# EAGLE design isobot-bt (EAGLE 5.08)
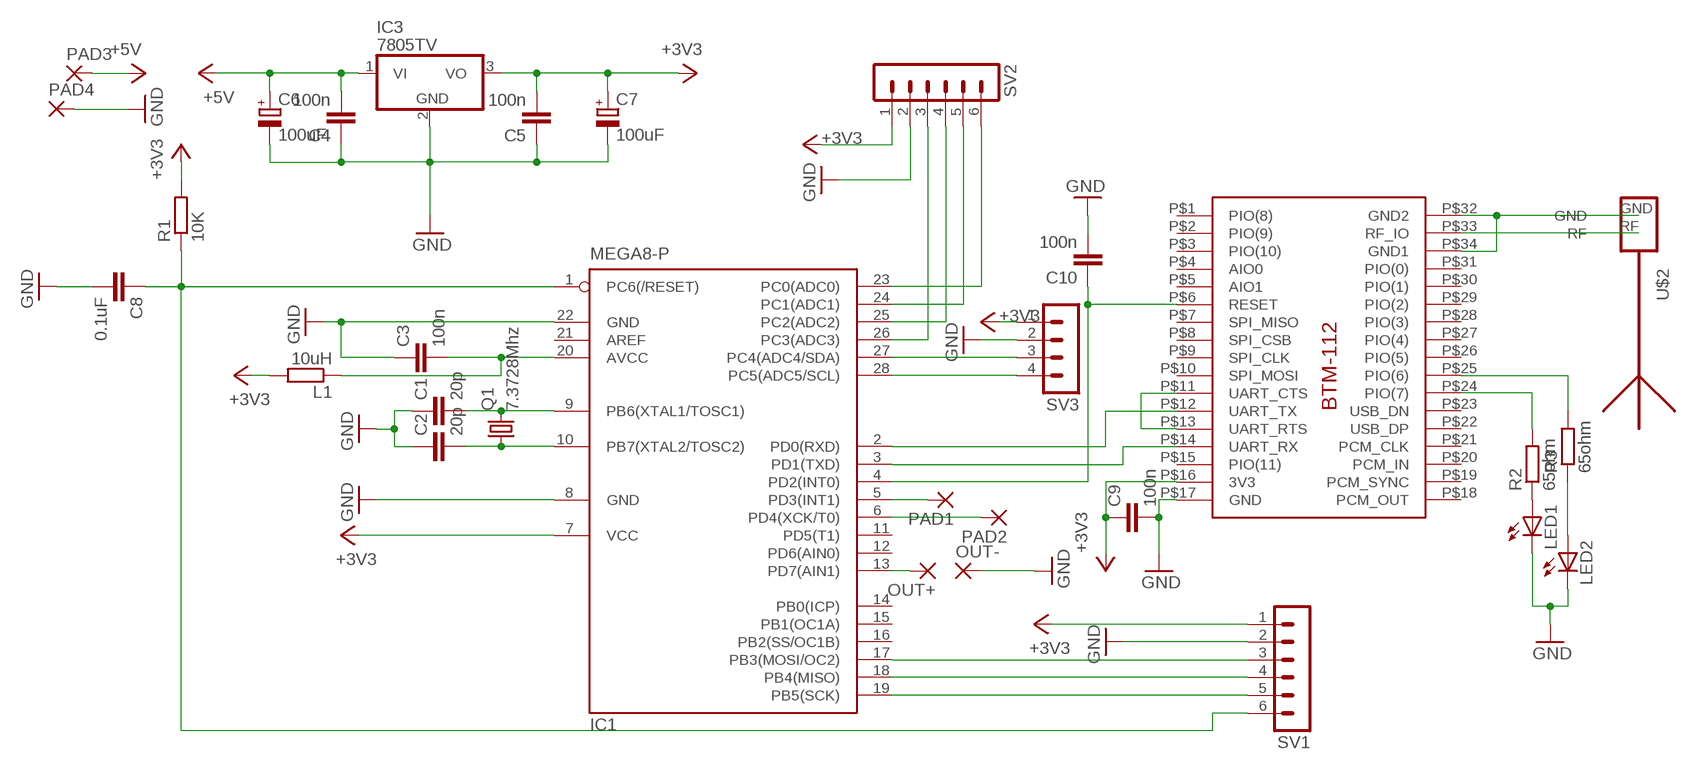
[diagram p0: schematic, sheet 1]

## Parts
C1  20p  C-EU025-025X050  [C025-025X050]
C2  20p  C-EU025-025X050  [C025-025X050]
C3  100n  C-EU025-025X050  [C025-025X050]
C4  100n  C-EU025-025X050  [C025-025X050]
C5  100n  C-EU025-025X050  [C025-025X050]
C6  100uF  CPOL-EUE2,5-6E  [E2,5-6E]
C7  100uF  CPOL-EUE2,5-6E  [E2,5-6E]
C8  0.1uF  C-EU025-025X050  [C025-025X050]
C9  100n  C-EU025-025X050  [C025-025X050]
C10  100n  C-EU025-025X050  [C025-025X050]
IC1  MEGA8-P  [DIL28-3]
IC3  7805TV  [TO220V]
L1  10uH  R-EU_0207/15  [0207/15]
LED1  LED3MM  [LED3MM]
LED2  LED3MM  [LED3MM]
OUT+  2,15/1,0  [2,15/1,0]
OUT-  2,15/1,0  [2,15/1,0]
PAD1  1,6/0,8  [1,6/0,8]
PAD2  1,6/0,8  [1,6/0,8]
PAD3  2,15/1,0  [2,15/1,0]
PAD4  2,15/1,0  [2,15/1,0]
Q1  7.3728Mhz  CRYSTALHC49S  [HC49/S]
R1  10K  R-EU_0207/10  [0207/10]
R2  65ohm  R-EU_0207/10  [0207/10]
R3  65ohm  R-EU_0207/10  [0207/10]
SV1  MA06-1  [MA06-1]
SV2  MA06-1  [MA06-1]
SV3  MA04-1  [MA04-1]
U$1  BTM-112  [BTM-112]
U$2  ANTENNA_1LEFT  [SWRA117D_LEFT]

## Nets
+3V3: C5.2 C7.+ C9.1 IC1.7(VCC) IC3.3(VO) L1.2 R1.2 SV1.1 SV2.1 SV3.1 U$1.P$16(3V3)
+5V: C4.2 C6.+ IC3.1(VI) PAD3.1(P)
GND: C1.1 C2.1 C3.1 C4.1 C5.1 C6.- C7.- C8.2 C9.2 C10.2 IC1.8(GND) IC1.22(GND) IC3.2(GND) LED1.K(C) LED2.K(C) OUT-.1(P) PAD4.1(P) SV1.2 SV2.2 SV3.2 U$1.P$17(GND)
N$1: U$1.P$33(RF_IO) U$2.RF
N$2: U$1.P$32(GND2) U$1.P$34(GND1) U$2.GND
N$3: IC1.3(PD1(TXD)) U$1.P$14(UART_RX)
N$4: IC1.2(PD0(RXD)) U$1.P$12(UART_TX)
N$5: C10.1 IC1.4(PD2(INT0)) U$1.P$6(RESET)
N$6: C1.2 IC1.9(PB6(XTAL1/TOSC1)) Q1.2
N$7: C2.2 IC1.10(PB7(XTAL2/TOSC2)) Q1.1
N$8: C3.2 IC1.20(AVCC) L1.1
N$9: IC1.17(PB3(MOSI/OC2)) SV1.3
N$10: IC1.19(PB5(SCK)) SV1.5
N$11: C8.1 IC1.1(PC6(/RESET)) R1.1 SV1.6
N$12: IC1.18(PB4(MISO)) SV1.4
N$13: IC1.26(PC3(ADC3)) SV2.3
N$14: IC1.25(PC2(ADC2)) SV2.4
N$15: IC1.24(PC1(ADC1)) SV2.5
N$16: IC1.23(PC0(ADC0)) SV2.6
N$17: IC1.28(PC5(ADC5/SCL)) SV3.4
N$18: IC1.27(PC4(ADC4/SDA)) SV3.3
N$19: R3.2 U$1.P$25(PIO(6))
N$20: IC1.13(PD7(AIN1)) OUT+.1(P)
N$21: LED1.A R2.1
N$22: LED2.A R3.1
N$23: R2.2 U$1.P$24(PIO(7))
N$25: IC1.5(PD3(INT1)) PAD1.1(P)
N$26: IC1.6(PD4(XCK/T0)) PAD2.1(P)
N$29: U$1.P$11(UART_CTS) U$1.P$13(UART_RTS)
Unconnected: IC1.11(PD5(T1)) IC1.12(PD6(AIN0)) IC1.14(PB0(ICP)) IC1.15(PB1(OC1A)) IC1.16(PB2(SS/OC1B)) IC1.21(AREF) U$1.P$1(PIO(8)) U$1.P$2(PIO(9)) U$1.P$3(PIO(10)) U$1.P$4(AIO0) U$1.P$5(AIO1) U$1.P$7(SPI_MISO) U$1.P$8(SPI_CSB) U$1.P$9(SPI_CLK) U$1.P$10(SPI_MOSI) U$1.P$15(PIO(11)) U$1.P$18(PCM_OUT) U$1.P$19(PCM_SYNC) U$1.P$20(PCM_IN) U$1.P$21(PCM_CLK) U$1.P$22(USB_DP) U$1.P$23(USB_DN) U$1.P$26(PIO(5)) U$1.P$27(PIO(4)) U$1.P$28(PIO(3)) U$1.P$29(PIO(2)) U$1.P$30(PIO(1)) U$1.P$31(PIO(0))

## Library data of the parts
C1-C5 C8-C10 = rcl:C-EU: CAPACITOR, European symbol
C6 C7 = rcl:CPOL-EU: POLARIZED CAPACITOR, European symbol
IC1 = atmel:MEGA8-P: MICROCONTROLLER 8 Kbytes FLASH, 1 kbytes SRAM, 512 bytes EEPROM, USART, 4-channel 10 bit ADC, 2-channel 8 bit ADC Pin compatible with Atmega48, ATMega88, ATMega168 Source: avr.lbr
IC3 = linear:78*: Positive VOLTAGE REGULATOR Source: http://cache.national.com/ds/LM/LM78L05.pdf http://www.fairchildsemi.com/ds/LM/LM7805.pdf
L1 R1-R3 = rcl:R-EU_: RESISTOR, European symbol
LED1 LED2 = led:LED: LED OSRAM: - CHIPLED LG R971, LG N971, LY N971, LG Q971, LY Q971, LO R971, LY R971 LH N974, LH R974 LS Q976, LO Q976, LY Q976 LO Q996 - Hyper CHIPLED LW Q18S LB Q993, LB Q99A, LB R99A - SideLED LS A670, LO A670, LY A670, LG A670, LP A670 LB A673, LV A673, LT A673, LW A673 LH A674 LY A675 LS A676, LA A676, LO A676, LY A676, LW A676 LS A679, LY A679, LG A679 - Hyper Micro SIDELED® LS Y876, LA Y876, LO Y876, LY Y876 LT Y87S - SmartLED LW L88C, LW L88S LB L89C, LB L89S, LG L890 LS L89K, LO L89K, LY L89K LS L896, LA L896, LO L896, LY L896 - TOPLED LS T670, LO T670, LY T670, LG T670, LP T670 LSG T670, LSP T670, LSY T670, LOP T670, LYG T670 LG T671, LOG T671, LSG T671 LB T673, LV T673, LT T673, LW T673 LH T674 LS T676, LA T676, LO T676, LY T676, LB T676, LH T676, LSB T676, LW T676 LB T67C, LV T67C, LT T67C, LS T67K, LO T67K, LY T67K, LW E67C LS E67B, LA E67B, LO E67B, LY E67B, LB E67C, LV E67C, LT E67C LW T67C LS T679, LY T679, LG T679 LS T770, LO T770, LY T770, LG T770, LP T770 LB T773, LV T773, LT T773, LW T773 LH T774 LS E675, LA E675, LY E675, LS T675 LS T776, LA T776, LO T776, LY T776, LB T776 LHGB T686 LT T68C, LB T68C - Hyper Mini TOPLED® LB M676 - Mini TOPLED Santana® LG M470 LS M47K, LO M47K, LY M47K Source: http://www.osram.convergy.de LUXEON: - LUMILED® LXK2-PW12-R00, LXK2-PW12-S00, LXK2-PW14-U00, LXK2-PW14-V00 LXK2-PM12-R00, LXK2-PM12-S00, LXK2-PM14-U00 LXK2-PE12-Q00, LXK2-PE12-R00, LXK2-PE12-S00, LXK2-PE14-T00, LXK2-PE14-U00 LXK2-PB12-K00, LXK2-PB12-L00, LXK2-PB12-M00, LXK2-PB14-N00, LXK2-PB14-P00, LXK2-PB14-Q00 LXK2-PR12-L00, LXK2-PR12-M00, LXK2-PR14-Q00, LXK2-PR14-R00 LXK2-PD12-Q00, LXK2-PD12-R00, LXK2-PD12-S00 LXK2-PH12-R00, LXK2-PH12-S00 LXK2-PL12-P00, LXK2-PL12-Q00, LXK2-PL12-R00 Source: www.luxeon.com KINGBRIGHT: KA-3528ASYC Source: www.kingbright.com
OUT+ OUT- PAD3 PAD4 = wirepad:2,15/1,0: THROUGH-HOLE PAD
PAD1 PAD2 = wirepad:1,6/0,8: THROUGH-HOLE PAD
Q1 = crystal:CRYSTAL: CRYSTAL
SV1 SV2 = con-lstb:MA06-1: PIN HEADER
SV3 = con-lstb:MA04-1: PIN HEADER
U$1 = BTM112:BTM-112
U$2 = ant-planar-1:ANTENNA_1

## Board
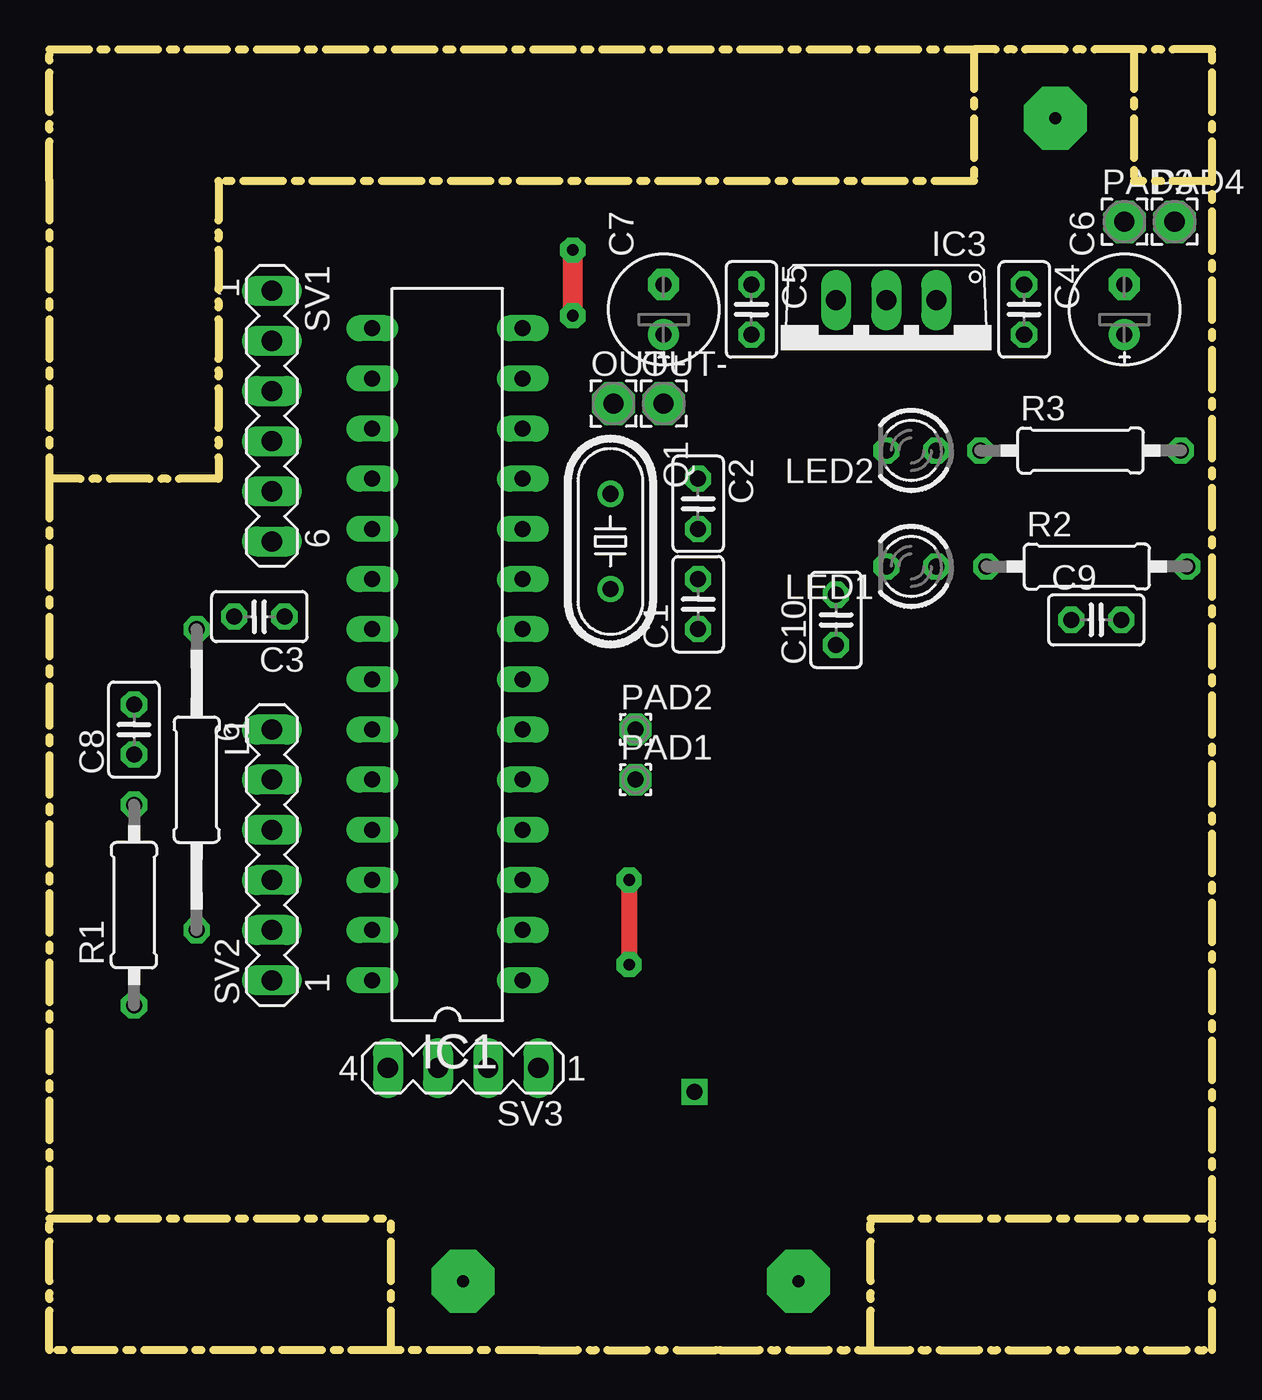
[diagram p1: board, top side]
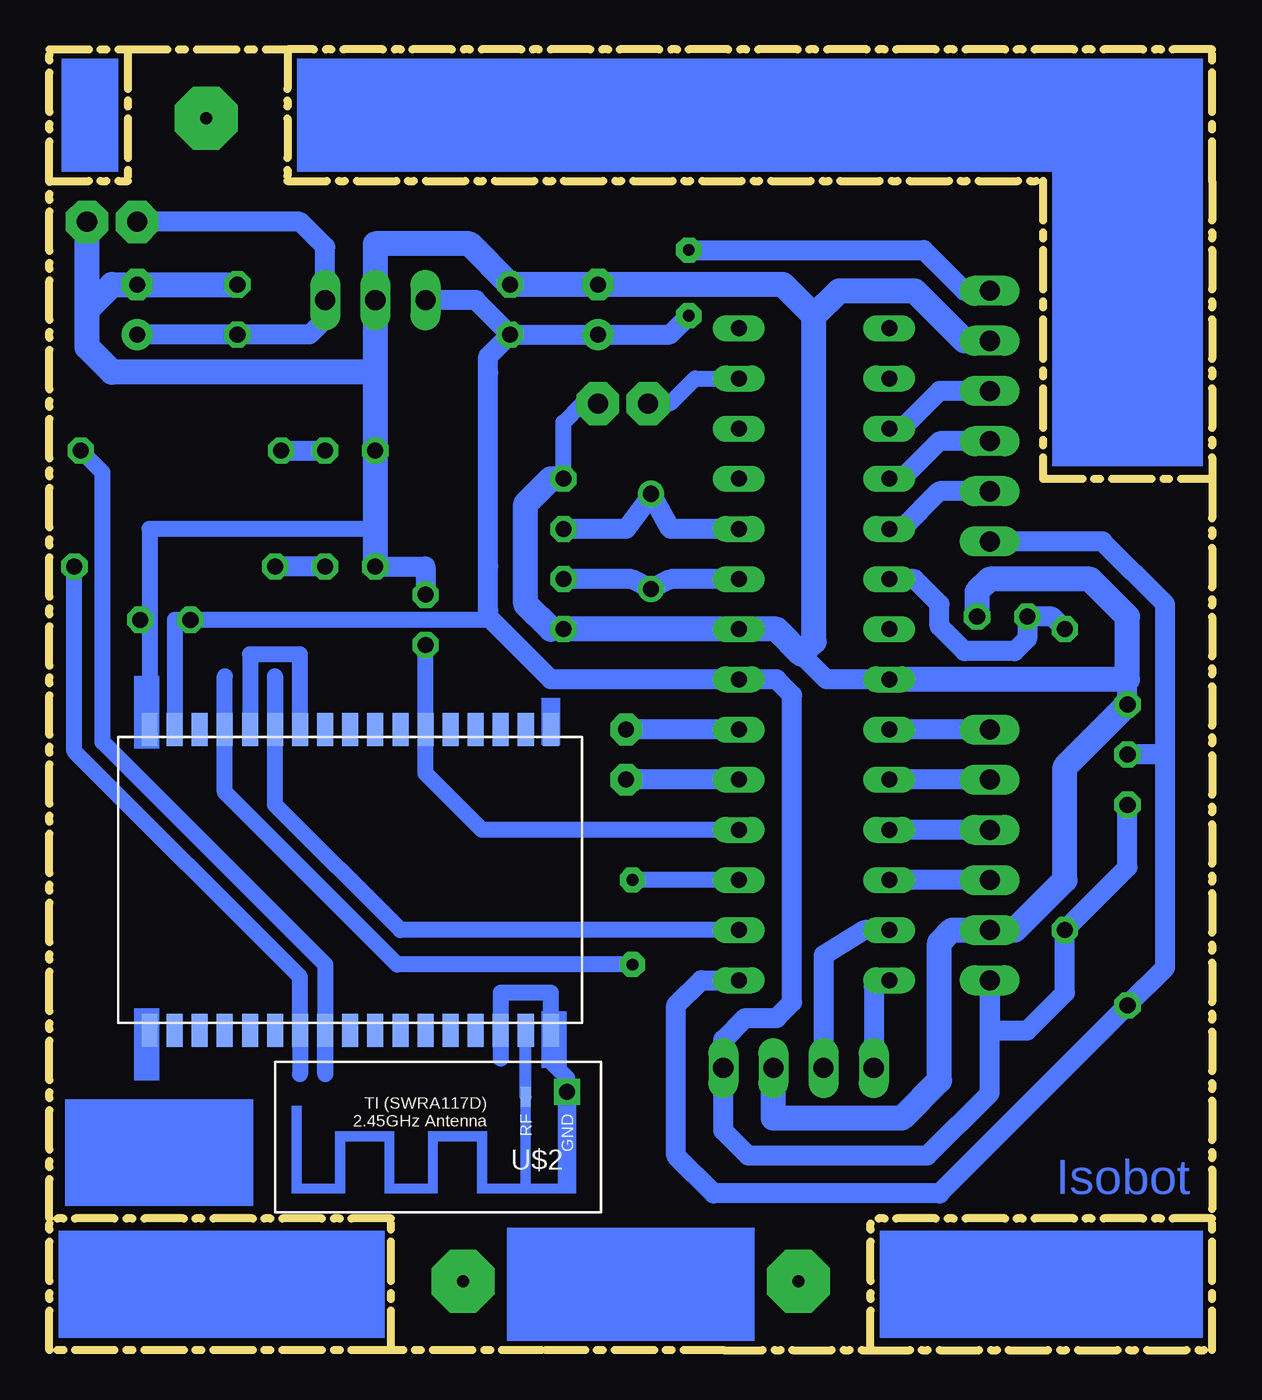
[diagram p2: board, bottom side, seen from below]

Size 58.9 x 65.88 mm. Coordinates in mm from the lower left corner, seen from the top.
Outline: 0,44.13 0,59.21 0,65.88 46.83,65.88
Outline: 0,44.13 0,6.67
Outline: 0,6.67 17.3,6.67 17.3,0
Outline: 58.9,6.67 41.59,6.67 41.59,0
Outline: 58.9,6.67 58.9,59.21
Outline: 58.9,59.21 54.93,59.21 54.93,65.88
Outline: 58.9,59.21 58.9,65.88 54.93,65.88
Outline: 54.93,65.88 46.83,65.88
Outline: 46.83,65.88 46.83,59.21 8.57,59.21 8.57,44.13 0,44.13
Outline: 17.3,0 24.77,0 33.97,0 41.59,0
Outline: 17.3,0 0,0 0,6.67
Outline: 41.59,0 58.9,0 58.9,6.67
Copper layers (1*16): Top 0.035mm / dielectric 1.5mm / Bottom 0.035mm
Design rules "default": minimum track width 10mil, minimum drill 24mil, track to track 8mil, track to pad 8mil, pad to pad 8mil, via to via 8mil, smd to smd 8mil, copper to edge 40mil, drill to drill 8mil, minimum pad ring 10mil, minimum via ring 8mil, stop-mask expansion 4mil, vias tented up to drill 0mil, thermal gap 10mil

### Footprints (pad centres in the part's own frame; a part is rotated, then mirrored left to right if it is on the bottom)
C025-025X050 = drill 0.813 octagon: 1 -1.27,0; 2 1.27,0
E2,5-6E = drill 0.813 pad 1.575 round: + -1.27,0 | drill 0.813 pad 1.575 octagon: - 1.27,0
DIL28-3 = drill 0.813 long: 1 -16.51,-3.81; 2 -13.97,-3.81; 3 -11.43,-3.81; 4 -8.89,-3.81; 5 -6.35,-3.81; 6 -3.81,-3.81; 7 -1.27,-3.81; 8 1.27,-3.81; 9 3.81,-3.81; 10 6.35,-3.81; 11 8.89,-3.81; 12 11.43,-3.81; 13 13.97,-3.81; 14 16.51,-3.81; 15 16.51,3.81; 16 13.97,3.81; 17 11.43,3.81; 18 8.89,3.81; 19 6.35,3.81; 20 3.81,3.81; 21 1.27,3.81; 22 -1.27,3.81; 23 -3.81,3.81; 24 -6.35,3.81; 25 -8.89,3.81; 26 -11.43,3.81; 27 -13.97,3.81; 28 -16.51,3.81
TO220V = drill 1.016 long: 1 -2.54,-2.54; 2 0,-2.54; 3 2.54,-2.54
0207/15 = drill 0.813 octagon: 1 -7.62,0; 2 7.62,0
LED3MM = drill 0.813 octagon: A -1.27,0; K 1.27,0
2,15/1,0 = drill 1.016 pad 2.159 octagon: 1 0,0
1,6/0,8 = drill 0.813 pad 1.6 octagon: 1 0,0
HC49/S = drill 0.813 round: 1 -2.413,0; 2 2.413,0
0207/10 = drill 0.813 octagon: 1 -5.08,0; 2 5.08,0
MA06-1 = drill 1.016 long: 1 -6.35,0; 2 -3.81,0; 3 -1.27,0; 4 1.27,0; 5 3.81,0; 6 6.35,0
MA04-1 = drill 1.016 long: 1 -3.81,0; 2 -1.27,0; 3 1.27,0; 4 3.81,0
BTM-112 = smd 1.676 x 0.813: P$1 -7.62,10.16; P$2 -7.62,8.89; P$3 -7.62,7.62; P$4 -7.62,6.35; P$5 -7.62,5.08; P$6 -7.62,3.81; P$7 -7.62,2.54; P$8 -7.62,1.27; P$9 -7.62,0; P$10 -7.62,-1.27; P$11 -7.62,-2.54; P$12 -7.62,-3.81; P$13 -7.62,-5.08; P$14 -7.62,-6.35; P$15 -7.62,-7.62; P$16 -7.62,-8.89; P$17 -7.62,-10.16; P$18 7.62,-10.16; P$19 7.62,-8.89; P$20 7.62,-7.62; P$21 7.62,-6.35; P$22 7.62,-5.08; P$23 7.62,-3.81; P$24 7.62,-2.54; P$25 7.62,-1.27; P$26 7.62,0; P$27 7.62,1.27; P$28 7.62,2.54; P$29 7.62,3.81; P$30 7.62,5.08; P$31 7.62,6.35; P$32 7.62,7.62; P$33 7.62,8.89; P$34 7.62,10.16
SWRA117D_LEFT = drill 0.8 square: GND 0.45,0.25 | smd 0.508 x 1.016: RF 2.55,0.51

### Placement (x,y rotation side)
C1  32.86,37.78 90 top
C2  32.86,42.86 270 top
C3  10.64,37.15 180 top
C4  49.37,52.71 270 top
C5  35.56,52.71 270 top
C6  54.45,52.71 90 top
C7  31.12,52.71 90 top
C8  4.29,31.43 90 top
C9  53.02,36.99 0 top
C10  39.85,36.99 90 top
IC1  20.16,35.24 90 top
IC3  42.39,50.64 180 top
L1  7.46,28.89 270 top
LED1  43.66,39.69 180 top
LED2  43.66,45.56 180 top
OUT+  28.58,47.94 0 top
OUT-  31.12,47.94 0 top
PAD1  29.69,28.89 0 top
PAD2  29.69,31.43 0 top
PAD3  54.45,57.15 0 top
PAD4  56.99,57.15 0 top
Q1  28.42,40.96 270 top
R1  4.29,22.54 90 top
R2  52.55,39.69 0 top
R3  52.23,45.56 0 top
SV1  11.27,47.31 270 top
SV2  11.27,25.08 90 top
SV3  20.95,14.29 180 top
U$1  43.66,23.81 270 bottom
U$2  32.23,13.33 180 bottom

### Tracks (layer width: path | path; a pad name or v marks a point on that pad's centre or on a via)
+3V3  (via drill 0.6 pad 1.27)
  Top 1.016: v26.51,52.39 v26.51,55.72
  Bottom 0.813: U$1.P$16 | U$1.P$16 52.55,36.99 51.91,36.99 C9.1 36.51,36.99 36.67,37.46
  Bottom 1.016: C5.2 C7.+ 27.46,51.43 v26.51,52.39 | R1.2 4.29,24.45 L1.2 7.46,18.1 9.37,16.19 11.27,16.19 SV2.1 11.27,13.02 14.45,9.84 23.5,9.84 24.77,11.11 SV3.1 24.77,15.72 23.65,16.83 22.07,16.83 21.27,17.62 21.27,33.18 22.07,33.97 IC1.7 33.5,33.97 36.67,37.15 36.67,37.46 36.67,39.69 36.67,49.53 36.67,50.32 C5.2 | SV1.1 12.54,53.66 14.61,55.72 v26.51,55.72 | IC3.3 37.31,53.18 C5.2
+5V
  Bottom 1.016: C6.+ C4.2 45.72,51.43 44.93,52.23 IC3.1 44.93,55.88 46.2,57.15 PAD3.1
GND
  Bottom 0.813: 42.39,49.69 42.7,49.53 | 53.82,36.99 53.82,41.59 42.39,41.59 | 53.82,36.99 U$1.P$17 | 53.82,36.99 C9.2 | C2.1 32.86,46.99 31.91,47.94 OUT-.1 | OUT-.1
  Bottom 1.016: C1.1 33.5,36.51 | 20.8,35.24 19.53,33.97 IC1.22 | C5.1 C7.- | C8.2 4.29,33.97 | 42.7,49.53 42.55,49.53 42.39,49.53 | 39.85,39.69 C10.2 | 39.85,39.69 | LED1.K 39.85,39.69
  Bottom 1.27: 33.5,36.51 34.77,37.78 34.77,42.86 33.5,44.13 C2.1 | C1.1 IC1.8 22.07,36.51 20.8,35.24 20.16,35.88 20.16,52.39 | C4.1 C6.- 55.72,53.98 56.99,52.7 | 20.16,52.39 21.75,53.98 C5.1 37.62,56.04 42.39,56.04 IC3.2 42.39,49.69 42.39,49.53 | 20.16,52.39 18.89,53.66 15.08,53.66 12.54,51.12 SV1.2 | C8.2 7.46,29.53 7.46,23.81 10,21.27 SV2.2 13.18,21.27 13.81,20.64 13.81,13.65 15.72,11.75 22.23,11.75 SV3.2 | IC1.22 4.29,33.97 4.29,37.15 6.19,39.05 11.27,39.05 11.91,38.42 C3.1 | 42.7,49.53 55.72,49.53 56.99,50.8 56.99,52.7 | 42.55,49.53 42.39,49.37 LED2.K 42.39,41.59 LED1.K | PAD4.1 56.99,52.71 56.99,52.7
N$1
  Bottom 0.61: U$2.RF U$1.P$33
N$2
  Bottom 0.813: U$2.GND 32.68,13.78 33.5,14.6 U$1.P$34 | U$1.P$34 | U$1.P$34 33.5,18.1 | 33.5,18.1 | 33.5,18.1 36.04,18.1 U$1.P$32 | U$1.P$32 36.04,14.76 | U$1.P$32
N$3  (via drill 0.6 pad 1.27)
  Top 0.813: v29.37,23.81 v29.37,19.53
  Bottom 0.813: IC1.3 v29.37,23.81 | v29.37,19.53 41.28,19.53 50.01,28.26 U$1.P$14 | U$1.P$14 | U$1.P$14 50.01,34.13 | U$1.P$14
N$4
  Bottom 0.813: IC1.2 41.12,21.27 47.47,27.62 47.47,34.13 47.47,33.97 U$1.P$12 | U$1.P$12
N$5
  Bottom 0.813: IC1.4 36.99,26.35 39.85,29.21 39.85,31.59 | 39.85,31.59 39.85,33.5 39.85,33.97 C10.1 | 39.85,31.59 U$1.P$6
N$6
  Bottom 1.016: IC1.9 27.43,39.05 Q1.2 29.4,39.05 C1.2
N$7
  Bottom 1.016: IC1.10 27.43,41.59 Q1.1 28.7,42.89 29.69,41.59 C2.2
N$8
  Bottom 1.016: L1.1 8.1,37.15 C3.2 9.37,36.04 10,35.4 12.54,35.4 13.81,36.67 13.81,37.78 15.08,39.05 IC1.20
N$9
  Bottom 1.016: IC1.17 15.72,46.67 13.81,48.58 SV1.3
N$10
  Bottom 1.016: IC1.19 15.72,41.59 13.81,43.5 SV1.5
N$11
  Bottom 1.016: 23.34,18.73 IC1.1 25.88,18.73 27.15,17.46 27.15,9.84 25.24,7.94 13.81,7.94 R1.1 2.38,19.37 2.38,30.16 | 2.38,30.16 2.38,37.78 5.56,40.96 SV1.6 | 2.38,30.16 C8.1
N$12
  Bottom 1.016: IC1.18 15.72,44.13 13.81,46.04 SV1.4
N$13
  Bottom 1.016: SV2.3 IC1.26
N$14
  Bottom 1.016: SV2.4 IC1.25
N$15
  Bottom 1.016: SV2.5 IC1.24
N$16
  Bottom 1.016: SV2.6 IC1.23
N$17
  Bottom 1.016: SV3.4 17.15,18.42 17.15,18.73 IC1.28
N$18
  Bottom 1.016: SV3.3 19.69,20 17.62,21.27 IC1.27
N$19
  Bottom 0.813: R3.2 56.2,44.45 56.2,30.8 44.93,19.53 U$1.P$25 | U$1.P$25 44.93,13.97 | 44.93,13.97 | 44.93,13.97 U$1.P$25 | U$1.P$25
N$20
  Bottom 0.813: OUT+.1 27.46,47.94 26.19,49.21 IC1.13
N$21
  Bottom 1.016: LED1.A R2.1
N$22
  Bottom 1.016: LED2.A | R3.1 LED2.A
N$23
  Bottom 0.813: R2.2 57.63,30.32 46.2,18.89 U$1.P$24 | U$1.P$24 | U$1.P$24 46.2,13.97 | U$1.P$24
N$24  (via drill 0.6 pad 3.2)
  other vias: 50.96,62.39
N$25
  Bottom 1.016: IC1.5 PAD1.1
N$26
  Bottom 1.016: IC1.6 PAD2.1
N$27  (via drill 0.6 pad 3.2)
  other vias: 20.96,3.49
N$28  (via drill 0.6 pad 3.2)
  other vias: 37.94,3.49
N$29
  Bottom 0.813: U$1.P$11 46.2,35.24 | 46.2,35.24 | 46.2,35.24 48.74,35.24 U$1.P$13
N$30
  Bottom 1.016: 35.56,53.82 35.56,53.98
(copper drawn outside any net)
  shapes: Bottom area x11

### Text on the board
Bottom: Isobot